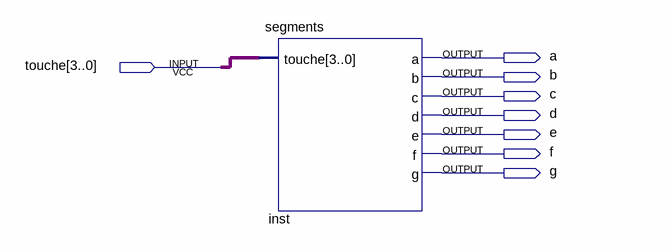
[diagram p0: schematic sheet]
// Quartus schematic seg.bdf as structural Verilog: 1 symbols, 8 pins
module seg (
  input  [3:0] touche,
  output a,
  output b,
  output c,
  output d,
  output e,
  output f,
  output g
);

  segments inst (.touche(touche), .a(a), .b(b), .c(c), .d(d), .e(e), .f(f), .g(g));
endmodule
